# EAGLE schematic E46 Driver Board - Full Design (EAGLE 7.2.0)
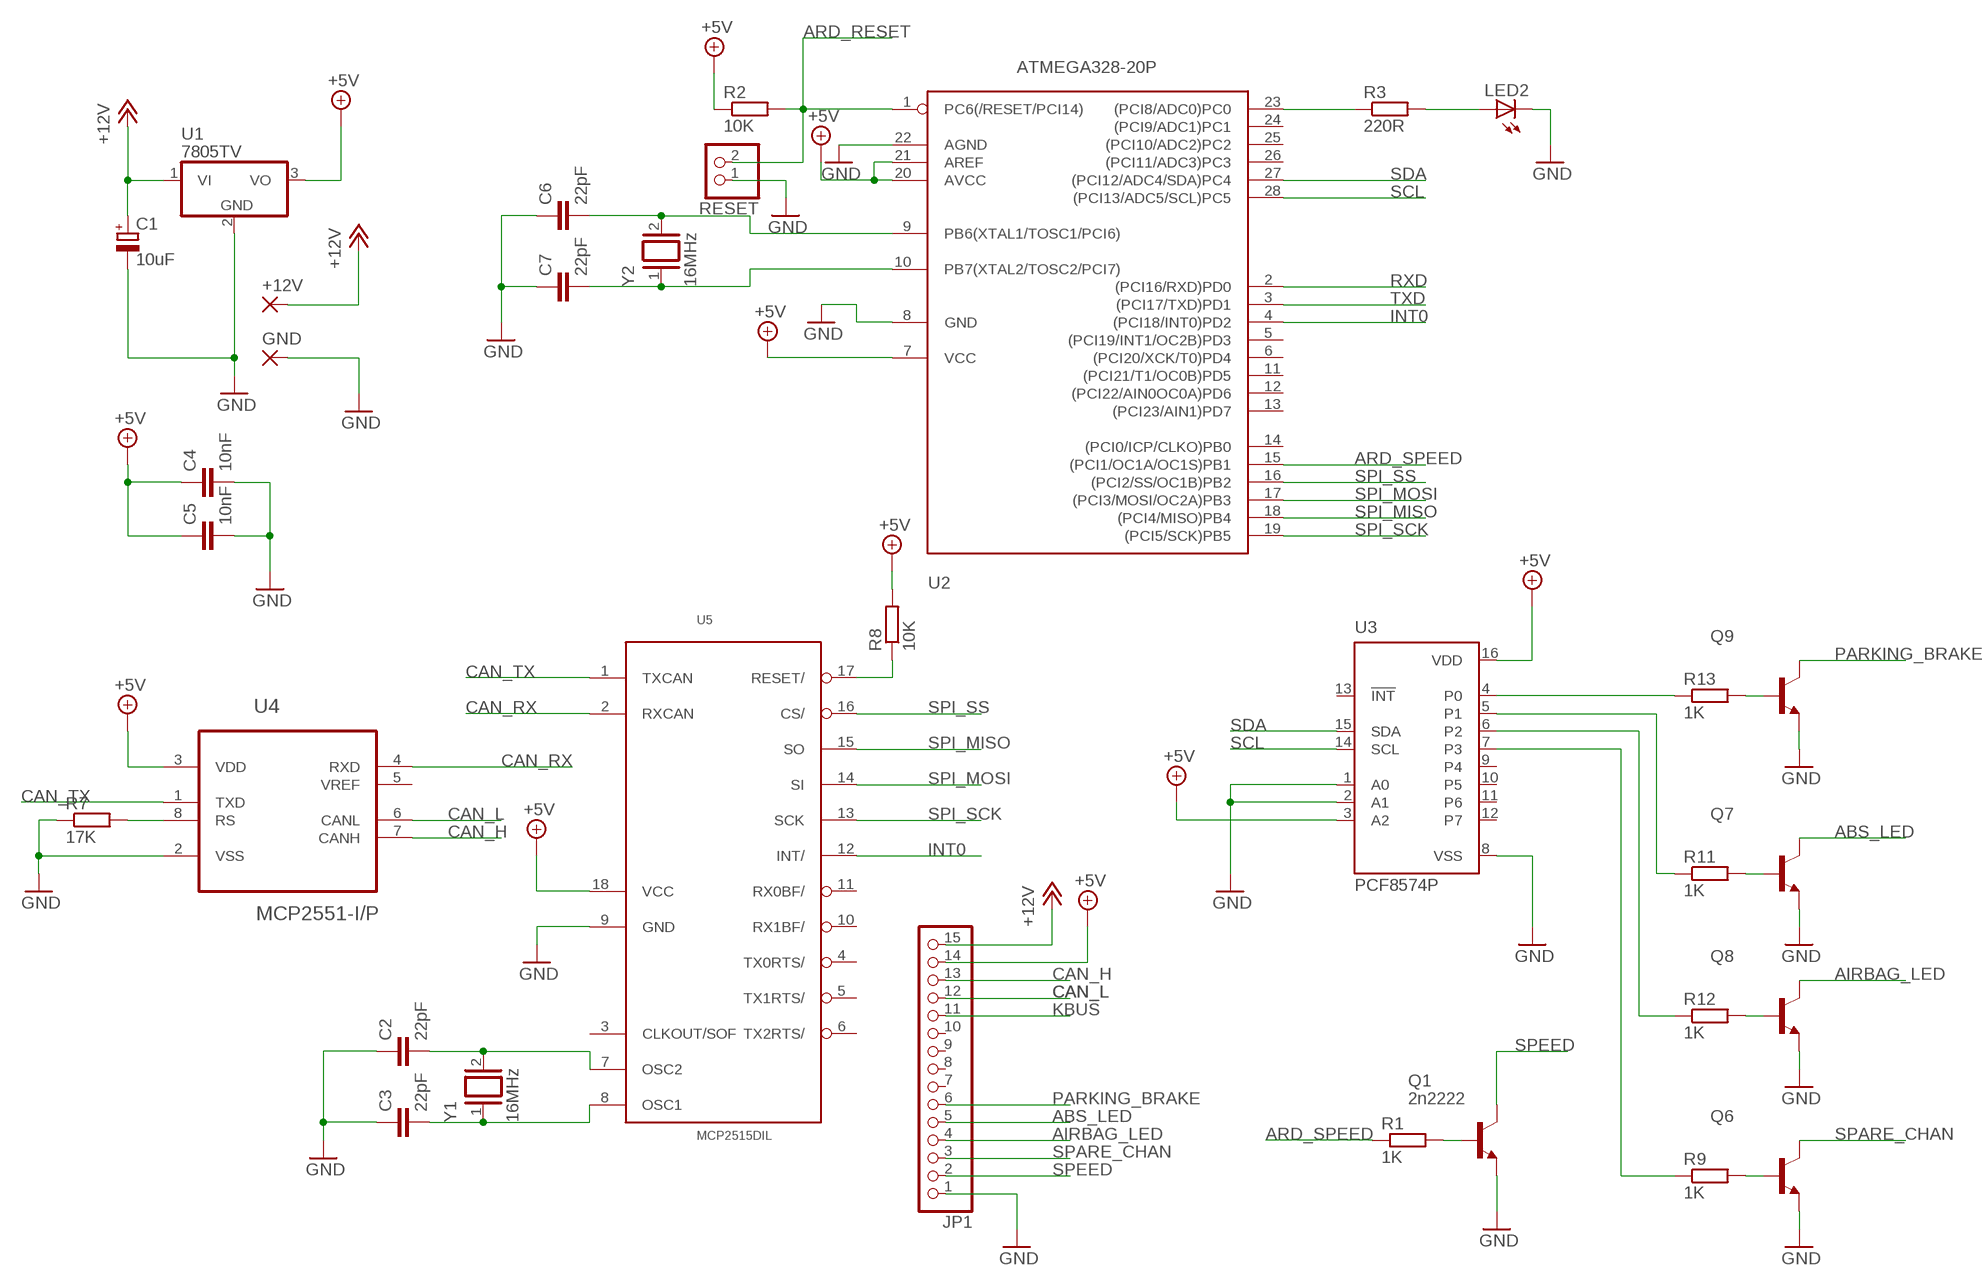
[diagram p0: schematic, sheet 1]

## Parts
+12V  2,54/1,1  [2,54/1,1]
C1  10uF  CPOL-EUE3.5-8  [E3,5-8]
C2  22pF  C-EU025-024X044  [C025-024X044]
C3  22pF  C-EU025-024X044  [C025-024X044]
C4  10nF  C-EU025-024X044  [C025-024X044]
C5  10nF  C-EU025-024X044  [C025-024X044]
C6  22pF  C-EU025-024X044  [C025-024X044]
C7  22pF  C-EU025-024X044  [C025-024X044]
GND  2,54/1,1  [2,54/1,1]
JP1  PINHD-1X15  [1X15]
LED2  LED5MM  [LED5MM]
Q1  2n2222  2N2222-NPN-TO92-EBC  [TO92-EBC]
Q6  2N2222-NPN-TO92-EBC  [TO92-EBC]
Q7  2N2222-NPN-TO92-EBC  [TO92-EBC]
Q8  2N2222-NPN-TO92-EBC  [TO92-EBC]
Q9  2N2222-NPN-TO92-EBC  [TO92-EBC]
R1  1K  R-EU_0204/5  [0204/5]
R2  10K  R-EU_0204/5  [0204/5]
R3  220R  R-EU_0204/5  [0204/5]
R7  17K  R-EU_0204/5  [0204/5]
R8  10K  R-EU_0204/5  [0204/5]
R9  1K  R-EU_0204/5  [0204/5]
R11  1K  R-EU_0204/5  [0204/5]
R12  1K  R-EU_0204/5  [0204/5]
R13  1K  R-EU_0204/5  [0204/5]
RESET  PINHD-1X2  [1X02]
U1  7805TV  [TO220V]
U2  ATMEGA328-20P  [DIL28-3]
U3  PCF8574P  [DIL16]
U4  MCP2551-I/P  [DIP254P762X432-8]
U5  MCP2515DIL  [DIL18]
Y1  16MHz  XTAL/S  [QS]
Y2  16MHz  XTAL/S  [QS]

## Nets
+5V: C4.1 C5.1 JP1.14 R2.1 R8.2 U1.3(VO) U2.7(VCC) U2.20(AVCC) U2.21(AREF) U3.3(A2) U3.16(VDD) U4.3(VDD) U5.18(VCC)
+12V: +12V.1(P) C1.+ JP1.15 U1.1(VI)
ABS_LED: JP1.5 Q7.C
AIRBAG_LED: JP1.4 Q8.C
ARD_RESET: R2.2 RESET.2 U2.1(PC6(/RESET/PCI14))
ARD_SPEED: R1.1 U2.15((PCI1/OC1A/OC1S)PB1)
CAN_H: JP1.13 U4.7(CANH)
CAN_L: JP1.12 U4.6(CANL)
CAN_RX: U4.4(RXD) U5.2(RXCAN)
CAN_TX: U4.1(TXD) U5.1(TXCAN)
GND: C1.- C2.1 C3.1 C4.2 C5.2 C6.1 C7.1 GND.1(P) JP1.1 LED2.K(C) Q1.E Q6.E Q7.E Q8.E Q9.E R7.1 RESET.1 U1.2(GND) U2.8(GND) U2.22(AGND) U3.1(A0) U3.2(A1) U3.8(VSS) U4.2(VSS) U5.9(GND)
INT0: U2.4((PCI18/INT0)PD2) U5.12(INT/)
KBUS: JP1.11
N$1: Q1.B R1.2
N$2: R8.1 U5.17(RESET/)
N$3: R3.1 U2.23((PCI8/ADC0)PC0)
N$4: C6.2 U2.9(PB6(XTAL1/TOSC1/PCI6)) Y2.2
N$5: R13.1 U3.4(P0)
N$6: Q6.B R9.2
N$7: LED2.A R3.2
N$8: R7.2 U4.8(RS)
N$9: C2.2 U5.7(OSC2) Y1.2
N$10: C3.2 U5.8(OSC1) Y1.1
N$11: R9.1 U3.7(P3)
N$16: Q7.B R11.2
N$17: Q8.B R12.2
N$18: Q9.B R13.2
N$19: R11.1 U3.5(P1)
N$20: R12.1 U3.6(P2)
PARKING_BRAKE: JP1.6 Q9.C
RXD: U2.2((PCI16/RXD)PD0)
SCL: U2.28((PCI13/ADC5/SCL)PC5) U3.14(SCL)
SDA: U2.27((PCI12/ADC4/SDA)PC4) U3.15(SDA)
SPARE_CHAN: JP1.3 Q6.C
SPEED: JP1.2 Q1.C
SPI_MISO: U2.18((PCI4/MISO)PB4) U5.15(SO)
SPI_MOSI: U2.17((PCI3/MOSI/OC2A)PB3) U5.14(SI)
SPI_SCK: U2.19((PCI5/SCK)PB5) U5.13(SCK)
SPI_SS: U2.16((PCI2/SS/OC1B)PB2) U5.16(CS/)
TXD: U2.3((PCI17/TXD)PD1)
Y2: C7.2 U2.10(PB7(XTAL2/TOSC2/PCI7)) Y2.1
Unconnected: JP1.7 JP1.8 JP1.9 JP1.10 U2.5((PCI19/INT1/OC2B)PD3) U2.6((PCI20/XCK/T0)PD4) U2.11((PCI21/T1/OC0B)PD5) U2.12((PCI22/AIN0OC0A)PD6) U2.13((PCI23/AIN1)PD7) U2.14((PCI0/ICP/CLKO)PB0) U2.24((PCI9/ADC1)PC1) U2.25((PCI10/ADC2)PC2) U2.26((PCI11/ADC3)PC3) U3.9(P4) U3.10(P5) U3.11(P6) U3.12(P7) U3.13(!INT) U4.5(VREF) U5.3(CLKOUT/SOF) U5.4(TX0RTS/) U5.5(TX1RTS/) U5.6(TX2RTS/) U5.10(RX1BF/) U5.11(RX0BF/)

## Library data of the parts
+12V GND = wirepad:2,54/1,1: THROUGH-HOLE PAD
C1 = resistor:CPOL-EU: POLARIZED CAPACITOR, European symbol
C2-C7 = rcl:C-EU: CAPACITOR, European symbol
JP1 = pinhead:PINHD-1X15: PIN HEADER
LED2 = led:LED: LED OSRAM: - CHIPLED LG R971, LG N971, LY N971, LG Q971, LY Q971, LO R971, LY R971 LH N974, LH R974 LS Q976, LO Q976, LY Q976 LO Q996 - Hyper CHIPLED LW Q18S LB Q993, LB Q99A, LB R99A - SideLED LS A670, LO A670, LY A670, LG A670, LP A670 LB A673, LV A673, LT A673, LW A673 LH A674 LY A675 LS A676, LA A676, LO A676, LY A676, LW A676 LS A679, LY A679, LG A679 - Hyper Micro SIDELED® LS Y876, LA Y876, LO Y876, LY Y876 LT Y87S - SmartLED LW L88C, LW L88S LB L89C, LB L89S, LG L890 LS L89K, LO L89K, LY L89K LS L896, LA L896, LO L896, LY L896 - TOPLED LS T670, LO T670, LY T670, LG T670, LP T670 LSG T670, LSP T670, LSY T670, LOP T670, LYG T670 LG T671, LOG T671, LSG T671 LB T673, LV T673, LT T673, LW T673 LH T674 LS T676, LA T676, LO T676, LY T676, LB T676, LH T676, LSB T676, LW T676 LB T67C, LV T67C, LT T67C, LS T67K, LO T67K, LY T67K, LW E67C LS E67B, LA E67B, LO E67B, LY E67B, LB E67C, LV E67C, LT E67C LW T67C LS T679, LY T679, LG T679 LS T770, LO T770, LY T770, LG T770, LP T770 LB T773, LV T773, LT T773, LW T773 LH T774 LS E675, LA E675, LY E675, LS T675 LS T776, LA T776, LO T776, LY T776, LB T776 LHGB T686 LT T68C, LB T68C - Hyper Mini TOPLED® LB M676 - Mini TOPLED Santana® LG M470 LS M47K, LO M47K, LY M47K Source: http://www.osram.convergy.de LUXEON: - LUMILED® LXK2-PW12-R00, LXK2-PW12-S00, LXK2-PW14-U00, LXK2-PW14-V00 LXK2-PM12-R00, LXK2-PM12-S00, LXK2-PM14-U00 LXK2-PE12-Q00, LXK2-PE12-R00, LXK2-PE12-S00, LXK2-PE14-T00, LXK2-PE14-U00 LXK2-PB12-K00, LXK2-PB12-L00, LXK2-PB12-M00, LXK2-PB14-N00, LXK2-PB14-P00, LXK2-PB14-Q00 LXK2-PR12-L00, LXK2-PR12-M00, LXK2-PR14-Q00, LXK2-PR14-R00 LXK2-PD12-Q00, LXK2-PD12-R00, LXK2-PD12-S00 LXK2-PH12-R00, LXK2-PH12-S00 LXK2-PL12-P00, LXK2-PL12-Q00, LXK2-PL12-R00 Source: www.luxeon.com KINGBRIGHT: KA-3528ASYC Source: www.kingbright.com
Q1 Q6-Q9 = transistor-neu-to92:*-NPN-: NPN Transistror
R1-R3 R7-R9 R11-R13 = rcl:R-EU_: RESISTOR, European symbol
RESET = pinhead:PINHD-1X2: PIN HEADER
U1 = linear:78*: Positive VOLTAGE REGULATOR Source: http://cache.national.com/ds/LM/LM78L05.pdf http://www.fairchildsemi.com/ds/LM/LM7805.pdf
U2 = atmega328:ATMEGA328*P: MICROCONTROLLER 32 kBytes FLASH 2 kBytes SRAM 1 kBytes EEPROM USART 8-channel 10 bit ADC
U3 = micro-philips:PCF8574: I2C-Bus Remote 8-bit I/O expander http://www.semiconductors.philips.com/acrobat_download/datasheets/PCF8574_4.pdf; MPN: PCF8574PN; OC_FARNELL: 204020; OC_NEWARK: 11N8515
U4 = TSHARP-LIB:MCP2551-I/P: High-Speed CAN Transceiver; DESCRIPTION: CAN CTRL; MPN: MCP2551-I/P; OC_FARNELL: 1292240; OC_NEWARK: 61K2947; PACKAGE: PDIP-8; SUPPLIER: Microchip
U5 = MCP2515_MT:MCP2515*: MCP2515 Standalone CAN-Controller by Microchip Eagle-Lib. by MartinThomas
Y1 Y2 = special:XTAL/S: CRYSTAL

## Net classes
0 default: clearance 0.205 mm